# Altium project STM32_PLC.PrjPcb (part 1 of 2)
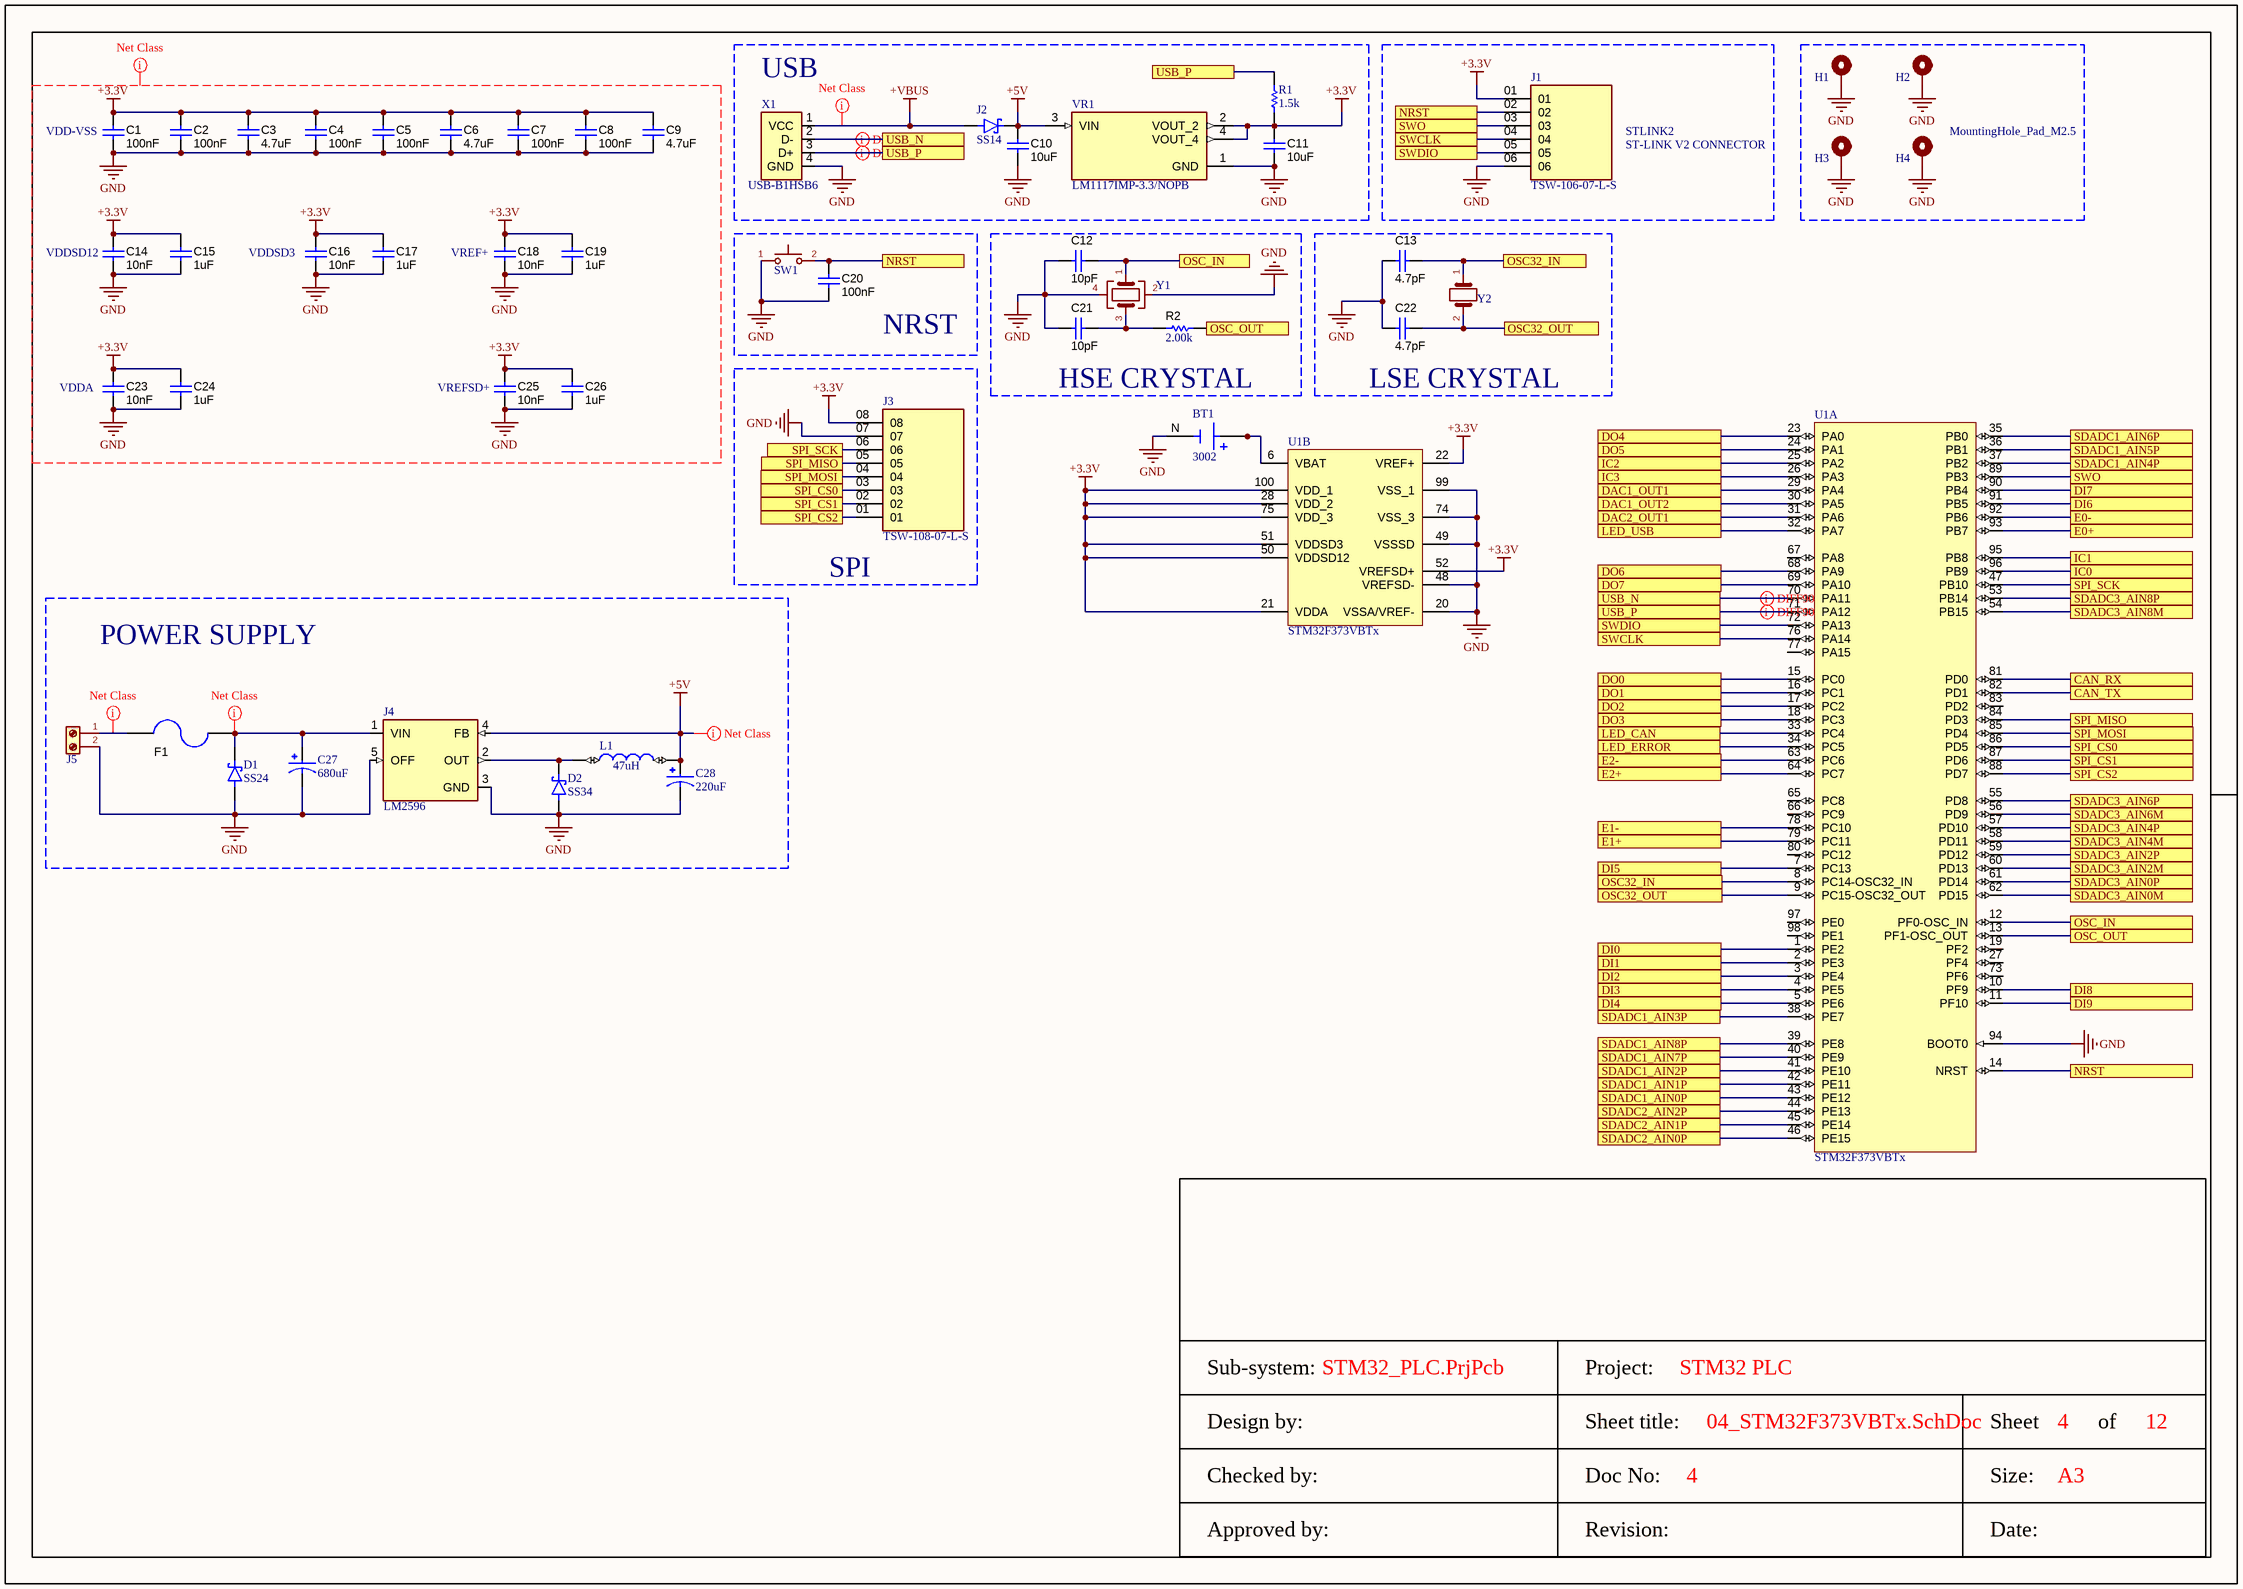
[diagram p0: 04_STM32F373VBTx.SchDoc]
MasterProject: STM32 PLC
9 sheets, 276 parts. Net scope: flat (ports and power ports of the same name join across sheets).
Board file: STM32_PLC.PcbDoc
Sheets:
  02_BLOCK DIAGRAM.SchDoc
  04_STM32F373VBTx.SchDoc
  06_DIGITAL.SchDoc
  07_SDDADC.SchDoc
  08_INPUTCAPTURE_ENCODER.SchDoc
  09_CAN.SchDoc
  10_SDADC.SchDoc
  11_DAC.SchDoc
  12_LED.SchDoc

## Sheet 02_BLOCK DIAGRAM.SchDoc
size 420 x 297 mm; SheetNumber: 2; SheetTotal: 12

### Notes on the sheet
- Sub-system:
- Project:
- Design by:
- Sheet title:
- Sheet
- of
- Checked by:
- Approved by:
- Doc No:
- Revision:
- Size:
- Date:
- A3

## Sheet 04_STM32F373VBTx.SchDoc
size 420 x 297 mm; SheetNumber: 4; SheetTotal: 12

### Parts
BT1  3002  [BAT_3002]
C1  ValueDisplayed: 100nF  [0603]  (hidden comment: CAP 100nF 0603)
C2  ValueDisplayed: 100nF  [0603]  (hidden comment: CAP 100nF 0603)
C3  ValueDisplayed: 4.7uF  [0603]  (hidden comment: CAP 4.7uF 0603)
C4  ValueDisplayed: 100nF  [0603]  (hidden comment: CAP 100nF 0603)
C5  ValueDisplayed: 100nF  [0603]  (hidden comment: CAP 100nF 0603)
C6  ValueDisplayed: 4.7uF  [0603]  (hidden comment: CAP 4.7uF 0603)
C7  ValueDisplayed: 100nF  [0603]  (hidden comment: CAP 100nF 0603)
C8  ValueDisplayed: 100nF  [0603]  (hidden comment: CAP 100nF 0603)
C9  ValueDisplayed: 4.7uF  [0603]  (hidden comment: CAP 4.7uF 0603)
C10  ValueDisplayed: 10uF  [0603]  (hidden comment: GCM188R71C105KA64D)
C11  ValueDisplayed: 10uF  [0603]  (hidden comment: GCM188R71C105KA64D)
C12  ValueDisplayed: 10pF  [0402L]  (hidden comment: CGA2B3X7R1H104K050BB)
C13  ValueDisplayed: 4.7pF  [0402L]  (hidden comment: GJM1555C1H4R7BB01D)
C14  ValueDisplayed: 10nF  [0603]  (hidden comment: CAP 10nF 0603)
C15  ValueDisplayed: 1uF  [0603]  (hidden comment: GCM188R71C105KA64D)
C16  ValueDisplayed: 10nF  [0603]  (hidden comment: CAP 10nF 0603)
C17  ValueDisplayed: 1uF  [0603]  (hidden comment: GCM188R71C105KA64D)
C18  ValueDisplayed: 10nF  [0603]  (hidden comment: CAP 10nF 0603)
C19  ValueDisplayed: 1uF  [0603]  (hidden comment: GCM188R71C105KA64D)
C20  ValueDisplayed: 100nF  [0603]  (hidden comment: CAP 100nF 0603)
C21  ValueDisplayed: 10pF  [0402L]  (hidden comment: CGA2B3X7R1H104K050BB)
C22  ValueDisplayed: 4.7pF  [0402L]  (hidden comment: GJM1555C1H4R7BB01D)
C23  ValueDisplayed: 10nF  [0603]  (hidden comment: CAP 10nF 0603)
C24  ValueDisplayed: 1uF  [0603]  (hidden comment: GCM188R71C105KA64D)
C25  ValueDisplayed: 10nF  [0603]  (hidden comment: CAP 10nF 0603)
C26  ValueDisplayed: 1uF  [0603]  (hidden comment: GCM188R71C105KA64D)
C27  680uF  [CAP_EEETK1V331AQ]
C28  220uF  [CAP_EEEFT1E471AV]
D1  SS24  [DIOM5336X265N]
D2  SS34  [DIOM5336X265N]
F1  0440005.WR  [CAPC4520X203N]  (value not drawn)
H1  MountingHole_Pad M2.5  [MountingHole_2.7mm_M2.5_DIN965_Pad]  (value not drawn)
H2  MountingHole_Pad M2.5  [MountingHole_2.7mm_M2.5_DIN965_Pad]  (value not drawn)
H3  MountingHole_Pad M2.5  [MountingHole_2.7mm_M2.5_DIN965_Pad]  (value not drawn)
H4  MountingHole_Pad M2.5  [MountingHole_2.7mm_M2.5_DIN965_Pad]  (value not drawn)
J1  TSW-106-07-L-S  [SAMTEC_TSW-106-07-L-S]
J2  SS14  [SMA]
J3  TSW-108-07-L-S  [SAMTEC_TSW-108-07-L-S]
J4  LM2596  [TO263-5]
J5  Terminal_01x02_P5.00  [TerminalBlock_Phoenix_PT-1,5-2-5.0-H_1x02_P5.00mm_Horizontal]  (value not drawn)
L1  47uH  [INDPM120120X800N]
R1  ValueDisplayed: 1.5k  [0603]  (hidden comment: RES 1.5K 0603)
R2  ValueDisplayed: 2.00k  [0402L]  (hidden comment: CRCW04021K00FKED)
SW1  SW_Push 3X6x2.5MM  [SW_SPST_FSMSM]  (value not drawn)
U1  STM32F373VBTx  [STM-LQFP100_N]  (parts A,B of 2)
VR1  LM1117IMP-3.3/NOPB  [VREG_LM1117IMP-3.3/NOPB]
X1  USB-B1HSB6  [OST_USB-B1HSB6]
Y1  Crystal 8MHz 3225  [Crystal_SMD_3225-4Pin_3.2x2.5mm_HandSoldering]  (value not drawn)
Y2  Crystal 32.768KHz 3215  [Crystal_SMD_EuroQuartz_EQ161-2Pin_3.2x1.5mm_HandSoldering]  (value not drawn)

### Blocks framed on the sheet
USB: C10 C11 J2 R1 VR1 X1
MountingHole_Pad_M2.5: H1-H4
NRST: C20 SW1
HSE CRYSTAL: C12 C21 R2 Y1
LSE CRYSTAL: C13 C22 Y2
SPI: J3
POWER SUPPLY: C27 C28 D1 D2 F1 J4 J5 L1

### Ports
CAN_RX (see 09_CAN[1A]), CAN_TX (see 09_CAN[1A]), DAC1_OUT1 (see 11_DAC[1A]), DAC1_OUT2 (see 11_DAC[1B]), DAC2_OUT1 (see 11_DAC[2A]), DI0 (see 05_INPUT[2A]), DI1 (see 05_INPUT[2B]), DI2 (see 05_INPUT[2B]), DI3 (see 05_INPUT[2C]), DI4 (see 05_INPUT[2C]), DI5 (see 05_INPUT[3A]), DI6 (see 05_INPUT[3B]), DI7 (see 05_INPUT[3B]), DI8 (see 05_INPUT[3C]), DI9 (see 05_INPUT[3C]), DO0 (see 06_DIGITAL[1A]), DO1 (see 06_DIGITAL[1B]), DO2 (see 06_DIGITAL[1B]), DO3 (see 06_DIGITAL[1C]), DO4 (see 06_DIGITAL[2A]), DO5 (see 06_DIGITAL[2B]), DO6 (see 06_DIGITAL[2B]), DO7 (see 06_DIGITAL[2C]), E0+ (see 08_INPUTCAPTURE_ENCODER[5B]), E0- (see 08_INPUTCAPTURE_ENCODER[5B]), E1+ (see 08_INPUTCAPTURE_ENCODER[5B]), E1- (see 08_INPUTCAPTURE_ENCODER[5B]), E2+ (see 08_INPUTCAPTURE_ENCODER[5B]), E2- (see 08_INPUTCAPTURE_ENCODER[5B]), IC0 (see 08_INPUTCAPTURE_ENCODER[3B]), IC1 (see 08_INPUTCAPTURE_ENCODER[3B]), IC2 (see 08_INPUTCAPTURE_ENCODER[3B]), IC3 (see 08_INPUTCAPTURE_ENCODER[3B]), LED_CAN (see 12_LED[2B]), LED_ERROR (see 12_LED[2B]), LED_USB (see 12_LED[2A]), NRST (see 04_STM32F373VBTx[3A], 04_STM32F373VBTx[4A]), NRST (see 04_STM32F373VBTx[3A], 04_STM32F373VBTx[6C]), NRST (see 04_STM32F373VBTx[4A], 04_STM32F373VBTx[6C]), OSC32_IN (see 04_STM32F373VBTx[5A]), OSC32_IN (see 04_STM32F373VBTx[5C]), OSC32_OUT (see 04_STM32F373VBTx[5A]), OSC32_OUT (see 04_STM32F373VBTx[5C]), OSC_IN (see 04_STM32F373VBTx[4A]), OSC_IN (see 04_STM32F373VBTx[6C]), OSC_OUT (see 04_STM32F373VBTx[4A]), OSC_OUT (see 04_STM32F373VBTx[6C]), SDADC1_AIN0P (see 10_SDADC[3B]), SDADC1_AIN1P (see 10_SDADC[3A]), SDADC1_AIN2P (see 10_SDADC[3A]), SDADC1_AIN3P (see 10_SDADC[2B]), SDADC1_AIN4P (see 10_SDADC[2B]), SDADC1_AIN5P (see 10_SDADC[2A]), SDADC1_AIN6P (see 10_SDADC[2A]), SDADC1_AIN7P (see 10_SDADC[2C]), SDADC1_AIN8P (see 10_SDADC[2B]), SDADC2_AIN0P (see 10_SDADC[3C]), SDADC2_AIN1P (see 10_SDADC[3B]), SDADC2_AIN2P (see 10_SDADC[3B]), SDADC3_AIN0M (see 07_SDDADC[3B]), SDADC3_AIN0P (see 07_SDDADC[3B]), SDADC3_AIN2M (see 07_SDDADC[3A]), SDADC3_AIN2P (see 07_SDDADC[3A]), SDADC3_AIN4M (see 07_SDDADC[2C]), SDADC3_AIN4P (see 07_SDDADC[2B]), SDADC3_AIN6M (see 07_SDDADC[2B]), SDADC3_AIN6P (see 07_SDDADC[2B]), SDADC3_AIN8M (see 07_SDDADC[2A]), SDADC3_AIN8P (see 07_SDDADC[2A]), SPI_CS0 (see 04_STM32F373VBTx[3B]), SPI_CS0 (see 04_STM32F373VBTx[6B]), SPI_CS1 (see 04_STM32F373VBTx[3B]), SPI_CS1 (see 04_STM32F373VBTx[6B]), SPI_CS2 (see 04_STM32F373VBTx[3B]), SPI_CS2 (see 04_STM32F373VBTx[6B]), SPI_MISO (see 04_STM32F373VBTx[3B]), SPI_MISO (see 04_STM32F373VBTx[6B]), SPI_MOSI (see 04_STM32F373VBTx[3B]), SPI_MOSI (see 04_STM32F373VBTx[6B]), SPI_SCK (see 04_STM32F373VBTx[3B]), SPI_SCK (see 04_STM32F373VBTx[6B]), SWCLK (see 04_STM32F373VBTx[4A]), SWCLK (see 04_STM32F373VBTx[5B]), SWDIO (see 04_STM32F373VBTx[4A]), SWDIO (see 04_STM32F373VBTx[5B]), SWO (see 04_STM32F373VBTx[4A]), SWO (see 04_STM32F373VBTx[6B]), USB_N (see 04_STM32F373VBTx[3A]), USB_N (see 04_STM32F373VBTx[5B]), USB_P (see 04_STM32F373VBTx[3A], 04_STM32F373VBTx[4A]), USB_P (see 04_STM32F373VBTx[3A], 04_STM32F373VBTx[5B]), USB_P (see 04_STM32F373VBTx[4A], 04_STM32F373VBTx[5B])

### Nets
+3.3V: C1.1 C2.1 C3.1 C4.1 C5.1 C6.1 C7.1 C8.1 C9.1 C11.1 C14.1 C15.1 C16.1 C17.1 C18.1 C19.1 C23.1 C24.1 C25.1 C26.1 J1.01 J3.08 R1.1 U1.21(VDDA) U1.22(VREF+) U1.28(VDD_2) U1.50(VDDSD12) U1.51(VDDSD3) U1.52(VREFSD+) U1.75(VDD_3) U1.100(VDD_1) VR1.2(VOUT_2) VR1.4(VOUT_4)
+5V: C10.1 C28.1 J2.P2(C) J4.4(FB) L1.2 VR1.3(VIN)
+VBUS: J2.P1(A) X1.1(VCC)
GND: BT1.N(NEG) C1.2 C2.2 C3.2 C4.2 C5.2 C6.2 C7.2 C8.2 C9.2 C10.2 C11.2 C12.2 C13.2 C14.2 C15.2 C16.2 C17.2 C18.2 C19.2 C20.2 C21.2 C22.2 C23.2 C24.2 C25.2 C26.2 C27.2 C28.2 D1.A D2.A H1.1 H2.1 H3.1 H4.1 J1.06 J3.07 J4.3(GND) J4.5(OFF) J5.2(Pin_2) SW1.1 U1.20(VSSA/VREF-) U1.48(VREFSD-) U1.49(VSSSD) U1.74(VSS_3) U1.94(BOOT0) U1.99(VSS_1) VR1.1(GND) X1.4(GND) Y1.2 Y1.4
CAN_RX: U1.81(PD0) ; port CAN_RX
CAN_TX: U1.82(PD1) ; port CAN_TX
DAC1_OUT1: U1.29(PA4) ; port DAC1_OUT1
DAC1_OUT2: U1.30(PA5) ; port DAC1_OUT2
DAC2_OUT1: U1.31(PA6) ; port DAC2_OUT1
DI0: U1.1(PE2) ; port DI0
DI1: U1.2(PE3) ; port DI1
DI2: U1.3(PE4) ; port DI2
DI3: U1.4(PE5) ; port DI3
DI4: U1.5(PE6) ; port DI4
DI5: U1.7(PC13) ; port DI5
DI6: U1.91(PB5) ; port DI6
DI7: U1.90(PB4) ; port DI7
DI8: U1.10(PF9) ; port DI8
DI9: U1.11(PF10) ; port DI9
DO0: U1.15(PC0) ; port DO0
DO1: U1.16(PC1) ; port DO1
DO2: U1.17(PC2) ; port DO2
DO3: U1.18(PC3) ; port DO3
DO4: U1.23(PA0) ; port DO4
DO5: U1.24(PA1) ; port DO5
DO6: U1.68(PA9) ; port DO6
DO7: U1.69(PA10) ; port DO7
E0+: U1.93(PB7) ; port E0+
E0-: U1.92(PB6) ; port E0-
E1+: U1.79(PC11) ; port E1+
E1-: U1.78(PC10) ; port E1-
E2+: U1.64(PC7) ; port E2+
E2-: U1.63(PC6) ; port E2-
IC0: U1.96(PB9) ; port IC0
IC1: U1.95(PB8) ; port IC1
IC2: U1.25(PA2) ; port IC2
IC3: U1.26(PA3) ; port IC3
LED_CAN: U1.33(PC4) ; port LED_CAN
LED_ERROR: U1.34(PC5) ; port LED_ERROR
LED_USB: U1.32(PA7) ; port LED_USB
NRST: C20.1 J1.02 SW1.2 U1.14(NRST) ; port NRST
OSC32_IN: C13.1 U1.8(PC14-OSC32_IN) Y2.1 ; port OSC32_IN
OSC32_OUT: C22.1 U1.9(PC15-OSC32_OUT) Y2.2 ; port OSC32_OUT
OSC_IN: C12.1 U1.12(PF0-OSC_IN) Y1.1 ; port OSC_IN
OSC_OUT: R2.2 U1.13(PF1-OSC_OUT) ; port OSC_OUT
SDADC1_AIN0P: U1.43(PE12) ; port SDADC1_AIN0P
SDADC1_AIN1P: U1.42(PE11) ; port SDADC1_AIN1P
SDADC1_AIN2P: U1.41(PE10) ; port SDADC1_AIN2P
SDADC1_AIN3P: U1.38(PE7) ; port SDADC1_AIN3P
SDADC1_AIN4P: U1.37(PB2) ; port SDADC1_AIN4P
SDADC1_AIN5P: U1.36(PB1) ; port SDADC1_AIN5P
SDADC1_AIN6P: U1.35(PB0) ; port SDADC1_AIN6P
SDADC1_AIN7P: U1.40(PE9) ; port SDADC1_AIN7P
SDADC1_AIN8P: U1.39(PE8) ; port SDADC1_AIN8P
SDADC2_AIN0P: U1.46(PE15) ; port SDADC2_AIN0P
SDADC2_AIN1P: U1.45(PE14) ; port SDADC2_AIN1P
SDADC2_AIN2P: U1.44(PE13) ; port SDADC2_AIN2P
SDADC3_AIN0M: U1.62(PD15) ; port SDADC3_AIN0M
SDADC3_AIN0P: U1.61(PD14) ; port SDADC3_AIN0P
SDADC3_AIN2M: U1.60(PD13) ; port SDADC3_AIN2M
SDADC3_AIN2P: U1.59(PD12) ; port SDADC3_AIN2P
SDADC3_AIN4M: U1.58(PD11) ; port SDADC3_AIN4M
SDADC3_AIN4P: U1.57(PD10) ; port SDADC3_AIN4P
SDADC3_AIN6M: U1.56(PD9) ; port SDADC3_AIN6M
SDADC3_AIN6P: U1.55(PD8) ; port SDADC3_AIN6P
SDADC3_AIN8M: U1.54(PB15) ; port SDADC3_AIN8M
SDADC3_AIN8P: U1.53(PB14) ; port SDADC3_AIN8P
SPI_CS0: J3.03 U1.86(PD5) ; port SPI_CS0
SPI_CS1: J3.02 U1.87(PD6) ; port SPI_CS1
SPI_CS2: J3.01 U1.88(PD7) ; port SPI_CS2
SPI_MISO: J3.05 U1.84(PD3) ; port SPI_MISO
SPI_MOSI: J3.04 U1.85(PD4) ; port SPI_MOSI
SPI_SCK: J3.06 U1.47(PB10) ; port SPI_SCK
SWCLK: J1.04 U1.76(PA14) ; port SWCLK
SWDIO: J1.05 U1.72(PA13) ; port SWDIO
SWO: J1.03 U1.89(PB3) ; port SWO
USB_N: U1.70(PA11) X1.2(D-) ; port USB_N
USB_P: R1.2 U1.71(PA12) X1.3(D+) ; port USB_P
NetBT1_P1: BT1.P1(POS) BT1.P2(POS) U1.6(VBAT)
NetC21_1: C21.1 R2.1 Y1.3
NetC27_1: C27.1 D1.C(K) F1.1 J4.1(VIN)
NetD2_C: D2.C(K) J4.2(OUT) L1.1
NetF1_2: F1.2 J5.1(Pin_1)

Not connected (* = marked no-connect by the designer): U1 19(PF2) 27(PF4) 65(PC8) 66(PC9) 67(PA8) 73(PF6) 77(PA15) 80(PC12) 83(PD2) 97(PE0) 98(PE1)

### Layout directives
net class PWR: +3.3V, +5V, +VBUS, GND, NetC27_1, NetF1_2
differential pair; differential pair class DIFF90: USB_N, USB_P

### Notes on the sheet
- (near C1) VDD-VSS
- STLINK2
- ST-LINK V2 CONNECTOR
- (near C14) VDDSD12
- (near C16) VDDSD3
- (near C18) VREF+
- (near C23) VDDA
- (near C25) VREFSD+
- Sub-system:
- Project:
- Design by:
- Sheet title:
- Sheet
- of
- Checked by:
- Approved by:
- Doc No:
- Revision:
- Size:
- Date:
- A3

### Library data of the parts
BT1 = 3002: Battery Holder: SMT, 1 Coin Cell, 20mm, PhosBronze/Tin-Nickel | Keystone Electronics 3002; MF: Keystone Electronics Corp.; SnapEDA_Link: https://www.snapeda.com/parts/3002/Keystone/view-part/?ref=snap; Package: NON STANDARD-2 Keystone; Value: *; MP: 3002; Check_prices: https://www.snapeda.com/parts/3002/Keystone/view-part/?ref=eda
C1 C2 C4 C5 C7 C8 C20 = CAP 100nF 0603: CAP, CERM, 100 nF, 25 V, +/- 10%, X7R, AEC-Q200 Grade 1, 0603; Manufacturer: MuRata; PartNumber: GCM188R70J225KE22D; TaMin_C: -55°C; Polarized: N; SizeAreaWB_mm2: 4.68; Value1: Unknown; U/M: EA; Value: 2.2uF; TaMax_C: 125°C; SizeZ_mm: 1; SizeX_mm: 1.6; SizeY_mm: 0.8; Value2: 6.3V; SizeArea_mm2: 1.28; CompType: Capacitor; AEC Qualified: Y; Cap_F: 2.2µF; AEC Category: Q200; Supplier Part Number 2: 81-GCM188R70J225KE2D; Publisher: Texas Instruments; Supplier 2: Mouser; TempCo: X7R; Published: 2008-06-19; RoHS: Y; MountType: SMT; Supplier 1: Digi-Key; PackageReference: 0603; Tolerance_%: 10%; Cap_Case: 0603; LatestRevisionDate: 2017-03-09; VDC_V: 6.3V; ComponentLink1Description: Datasheet link; AEC Grade: 1; Supplier Part Number 1: 490-5316-1-ND; Technology: Ceramic; ComponentLink1URL: http://psearch.en.murata.com/capacitor/product/GCM188R70J225KE22%23.pdf
C3 C6 C9 = CAP 4.7uF 0603: CAP, CERM, 4.7 uF, 10 V, +/- 10%, X7R, AEC-Q200 Grade 1, 0603; Manufacturer: MuRata; PartNumber: GCM188R70J225KE22D; TaMin_C: -55°C; Polarized: N; SizeAreaWB_mm2: 4.68; Value1: Unknown; U/M: EA; Value: 2.2uF; TaMax_C: 125°C; SizeZ_mm: 1; SizeX_mm: 1.6; SizeY_mm: 0.8; Value2: 6.3V; SizeArea_mm2: 1.28; CompType: Capacitor; AEC Qualified: Y; Cap_F: 2.2µF; AEC Category: Q200; Supplier Part Number 2: 81-GCM188R70J225KE2D; Publisher: Texas Instruments; Supplier 2: Mouser; TempCo: X7R; Published: 2008-06-19; RoHS: Y; MountType: SMT; Supplier 1: Digi-Key; PackageReference: 0603; Tolerance_%: 10%; Cap_Case: 0603; LatestRevisionDate: 2017-03-09; VDC_V: 6.3V; ComponentLink1Description: Datasheet link; AEC Grade: 1; Supplier Part Number 1: 490-5316-1-ND; Technology: Ceramic; ComponentLink1URL: http://psearch.en.murata.com/capacitor/product/GCM188R70J225KE22%23.pdf
C10 C11 C15 C17 C19 C24 C26 = CAP 1uF 0603: CAP, CERM, 1 uF, 16 V, +/- 10%, X7R, AEC-Q200 Grade 1, 0603; Manufacturer: MuRata; TaMin_C: -55°C; Polarized: N; SizeAreaWB_mm2: 4.68; Value1: Unknown; U/M: EA; Value: 1uF; TaMax_C: 125°C; SizeZ_mm: 1; SizeX_mm: 1.6; SizeY_mm: 0.8; Value2: 16V; SizeArea_mm2: 1.28; CompType: Capacitor; AEC Qualified: Y; Cap_F: 1µF; AEC Category: Q200; Supplier Part Number 2: 81-GCM188R71C105K64D; Publisher: Texas Instruments; Supplier 2: Mouser; TempCo: X7R; Published: 2008-06-19; RoHS: Y; MountType: SMT; Supplier 1: Digi-Key; PackageReference: 0603; Tolerance_%: 10%; Cap_Case: 0603; LatestRevisionDate: 2017-03-09; PartNumber: GCM188R71C105KA64D; VDC_V: 16V; ComponentLink1Description: Datasheet link; AEC Grade: 1; Supplier Part Number 1: 490-5241-6-ND; Technology: Ceramic; ComponentLink1URL: http://psearch.en.murata.com/capacitor/product/GCM188R71C105KA64%23.pdf
C12 C21 = CAP 10pF 0402 50V: CAP, CERM, 10 pF, 50 V, +/- 5%, X7R, AEC-Q200 Grade 1, 0402; Manufacturer: TDK; TaMin_C: -55°C; ESR_ohm: 0.039064; Polarized: N; SizeAreaWB_mm2: 3; Value1: 0.039064 ohm; U/M: EA; Value: 0.1uF; TaMax_C: 125°C; Tolerance_%: 10%; SizeZ_mm: 0.6; SizeX_mm: 1; SizeY_mm: 0.5; Cap_Case: 0402; Value2: 50V; CompType: Capacitor; AEC Qualified: Y; Cap_F: 100nF; IRMS_A: 8.14669dA; AEC Category: Q200; Supplier Part Number 2: 04X3148; Publisher: Texas Instruments; Supplier 2: Newark; Supplier Part Number 3: 810-CGA2B3X7R1H104K; TempCo: X7R; Supplier 3: Mouser; Published: 2008-06-19; RoHS: Y; MountType: SMT; Supplier 1: Digi-Key; PackageReference: 0402; SizeArea_mm2: 0.5; LatestRevisionDate: 2017-03-09; PartNumber: CGA2B3X7R1H104K050BB; VDC_V: 50V; ComponentLink1Description: Datasheet link; AEC Grade: 1; Supplier Part Number 1: 445-6899-1-ND; Technology: Ceramic; ComponentLink1URL: https://product.tdk.com/en/search/capacitor/ceramic/mlcc/info?part_no=CGA2B3X7R1H104K050BB
C13 C22 = CAP 4.7pF 0402: CAP, CERM, 4.7 pF, 50 V, +/- 2%, C0G/NP0, 0402; Manufacturer: MuRata; TaMin_C: -55°C; Polarized: N; SizeAreaWB_mm2: 3; Value1: Unknown; U/M: EA; Value: 4.7pF; TaMax_C: 125°C; SizeZ_mm: 0.6; SizeX_mm: 1; SizeY_mm: 0.5; Cap_Case: 0402; Value2: 50V; CompType: Capacitor; AEC Category: Q200; Supplier Part Number 2: 81-GJM1555C1H4R7BB01; Publisher: Texas Instruments; Supplier 2: Mouser; TempCo: C0G/NP0; Published: 2008-06-19; RoHS: Y; MountType: SMT; Supplier 1: Digi-Key; PackageReference: 0402; Tolerance_%: 2%; SizeArea_mm2: 0.5; LatestRevisionDate: 2017-03-09; PartNumber: GJM1555C1H4R7BB01D; AEC Qualified: N; Cap_F: 4.7pF; VDC_V: 50V; ComponentLink1Description: Datasheet link; AEC Grade: N/A; Supplier Part Number 1: 490-8102-1-ND; Technology: Ceramic; ComponentLink1URL: http://psearch.murata.com/capacitor/product/GJM1555C1H4R7BB01%23.pdf
C14 C16 C18 C23 C25 = CAP 10nF 0603: CAP, CERM, 10 nF, 50 V, +/- 10%, X7R, AEC-Q200 Grade 1, 0603; Manufacturer: MuRata; PartNumber: GCM188R70J225KE22D; TaMin_C: -55°C; Polarized: N; SizeAreaWB_mm2: 4.68; Value1: Unknown; U/M: EA; Value: 2.2uF; TaMax_C: 125°C; SizeZ_mm: 1; SizeX_mm: 1.6; SizeY_mm: 0.8; Value2: 6.3V; SizeArea_mm2: 1.28; CompType: Capacitor; AEC Qualified: Y; Cap_F: 2.2µF; AEC Category: Q200; Supplier Part Number 2: 81-GCM188R70J225KE2D; Publisher: Texas Instruments; Supplier 2: Mouser; TempCo: X7R; Published: 2008-06-19; RoHS: Y; MountType: SMT; Supplier 1: Digi-Key; PackageReference: 0603; Tolerance_%: 10%; Cap_Case: 0603; LatestRevisionDate: 2017-03-09; VDC_V: 6.3V; ComponentLink1Description: Datasheet link; AEC Grade: 1; Supplier Part Number 1: 490-5316-1-ND; Technology: Ceramic; ComponentLink1URL: http://psearch.en.murata.com/capacitor/product/GCM188R70J225KE22%23.pdf
C27 = CAP ALUMINUM: CAPACITOR ALUM ELEC, 330UF, 20%, 35V, SMD; Product Range:PANASONIC - TK Series; Capacitance:330ÂµF; Capacitance Tolerance:Â± 20%; Capacitor Case Style:SMD; Diameter:12.5mm; ESR:0.12ohm; Height:13.5mm; Operating Temperature Max:125Â°C ;RoHS Compliant: Yes; MP: EEETK1V331AQ; Value: *; Price: None; Package: RADIAL-2 Panasonic; MF: Panasonic; Availability: No availability data; Check_prices: https://www.snapeda.com/parts/EEETK1V331AQ/Panasonic/view-part/5787067/?ref=eda; SnapEDA_Link: https://www.snapeda.com/parts/EEETK1V331AQ/Panasonic/view-part/5787067/?ref=snap
C28 = CAP ALUMINUM 8X10.5MM: Aluminum Electrolytic Capacitors, FT-V (????????) Series, 470uF +/- 20%, 25V, Surface mount type(8x10.5mm) Vibration-proof product; MF: Panasonic; MP: EEE-FT1E471AV; SnapEDA_Link: https://www.snapeda.com/parts/EEE-FT1E471AV/Panasonic/view-part/?ref=snap; Package: RADIAL-2 Panasonic; Value: *; Check_prices: https://www.snapeda.com/parts/EEE-FT1E471AV/Panasonic/view-part/?ref=eda
D1 D2 = SS24: Diode Schottky 40V 2A Surface Mount DO-214AA (SMB); MF: ON Semiconductor; Package: DO-214AA ON Semiconductor; Price: None; Value: *; SnapEDA_Link: https://www.snapeda.com/parts/SS24/Onsemi/view-part/?ref=snap; MP: SS24; Availability: In Stock; Check_prices: https://www.snapeda.com/parts/SS24/Onsemi/view-part/?ref=eda
F1 = FUSE 1808: Fuse, 5 A, 32VAC/VDC, SMD; Manufacturer: Littelfuse; Irating_A: 5A; SizeAreaWB_mm2: 10.92; Interrupt_AC: 50A; VAC_V: 32V; SizeZ_mm: 1.35; SizeX_mm: 3.2; SizeY_mm: 1.6; SizeArea_mm2: 5.12; Rtyp_Ohm: 0.012; MeltingTyp: 4.761; ComponentLink1URL: http://www.littelfuse.com/~/media/electronics/datasheets/fuses/littelfuse_fuse_440_datasheet.pdf.pdf; Supplier Part Number 2: 64R8013; Supplier 2: Newark; Supplier Part Number 3: 576-0440005.WR; Supplier 3: Mouser; RoHS: Y; MountType: SMT; Interrupt_DC: 50A; Supplier 1: Digi-Key; PackageReference: 1206; CompType: Fuse; PartNumber: 0440005.WR; VDC_V: 32V; ComponentLink1Description: Datasheet URL; Supplier Part Number 1: F1608CT-ND
J1 = TSW-106-07-L-S: MF: Samtec Inc.; Package: None; MP: TSW-106-07-L-S; Price: None; Value: *; Availability: Unavailable
J2 = SS14: Diode Schottky 40 V 1A Surface Mount DO-214AC (SMA); MF: ON; SnapEDA_Link: https://www.snapeda.com/parts/SS14/Onsemi/view-part/?ref=snap; Package: SMA-2 ON Semiconductor; Value: *; MP: SS14; Check_prices: https://www.snapeda.com/parts/SS14/Onsemi/view-part/?ref=eda
J3 = TSW-108-07-L-S: MF: Samtec Inc.; Availability: Unavailable; Price: None; Package: None; Value: *; MP: TSW-108-07-L-S
J4 = LM2596: MF: Texas Instruments; SnapEDA_Link: https://www.snapeda.com/parts/LM2596/Texas+Instruments/view-part/?ref=snap; Package: Package; Value: *; MP: LM2596; Check_prices: https://www.snapeda.com/parts/LM2596/Texas+Instruments/view-part/?ref=eda
L1 = CDRH127_LDNP-221MC: 220 ÂµH Shielded - Inductor 1.45 A 338mOhm Max Nonstandard; MF: Sumida America; MP: CDRH127/LDNP-221MC; SnapEDA_Link: https://www.snapeda.com/parts/CDRH127/LDNP-221MC/Sumida+America+Components+Inc./view-part/?ref=snap; Package: Nonstandard Sumida; Value: *; Check_prices: https://www.snapeda.com/parts/CDRH127/LDNP-221MC/Sumida+America+Components+Inc./view-part/?ref=eda
R1 = RES 1.5K 0603 1%: RES, 1.5K, 1%, 0.1 W, AEC-Q200 Grade 0, 0603; Manufacturer: Vishay-Dale; PartNumber: CRCW060320R0JNEA; Power_W: 100mW; TempCo: 200 ppm/C; Value_Code: 20R0; Value1: 5%; Value: 20; EIA_Code: E24; SizeX_mm: 1.6; SizeY_mm: 0.8; SizeZ_mm: 1; Value2: 0.1W; SizeArea_mm2: 1.28; CompType: Resistor; AEC Qualified: Y; VDC_V: 75V; AEC Category: Q200; AEC Grade: 0; Supplier Part Number 2: 59M6784; Supplier 2: Newark; Supplier Part Number 3: 71-CRCW0603J-20-E3; Supplier 3: Mouser; RoHS: E; MountType: SMT; Supplier 1: Digi-Key; PackageReference: 0603; Tolerance_%: 5%; Res_ohm: 20; ComponentLink1Description: Datasheet link; Supplier Part Number 1: 541-20GCT-ND; Technology: Thick Film; ComponentLink1URL: http://www.vishay.com/docs/20035/dcrcwe3.pdf
R2 = RES 2K 0402: RES, 2.00 k, 5%, 0.063 W, AEC-Q200 Grade 0, 0402; Manufacturer: Vishay-Dale; Power_W: 63mW; TempCo: 100 ppm/C; Value_Code: 1k00; Value1: 1%; Value: 1.00k; EIA_Code: E96; Res_ohm: 1k; SizeX_mm: 1; SizeY_mm: 0.5; SizeZ_mm: 0.6; Value2: 0.063W; CompType: Resistor; AEC Qualified: Y; VDC_V: 50V; AEC Category: Q200; AEC Grade: 0; Supplier Part Number 2: 52K6545; Supplier 2: Newark; Supplier Part Number 3: 71-CRCW0402-1.0K-E3; Supplier 3: Mouser; RoHS: E; MountType: SMT; Supplier 1: Digi-Key; PackageReference: 0402; Tolerance_%: 1%; SizeArea_mm2: 0.5; PartNumber: CRCW04021K00FKED; ComponentLink1Description: Datasheet link; Supplier Part Number 1: 541-1.00KLCT-ND; Technology: Thick Film; ComponentLink1URL: http://www.vishay.com/docs/20035/dcrcwe3.pdf
U1 = STM32F373VBT7: ARM Cortex-M4 32-bit MCU, 128 KB Flash, 24 KB Internal RAM, 84 I/Os, 100-pin LQFP, -40 to 105 degC, Tray; Supply Voltage(Vcc) min (V): 2; Operating Frequency(F) (Processor speed) (MHz): 72; I/Os (High Current): 84; Internal RAM Size (kB): 24; FLASH Size (Prog) (kB): 128; DatasheetVersion: Rev. 3; Mounting Technology: Surface Mount; ComponentLink1Description: Manufacturer URL; Core: ARM Cortex-M4; ComponentLink2Description: Datasheet; PackageReference: LQFP100; PackageVersion: Rev. 1, 06/2013; ComponentLink3URL: http://www.st.com/st-web-ui/static/active/en/resource/technical/document/data_brief/DM00071938.pdf; PackageDescription: 100-Pin Low Profile Quad Flat Package, 14 x 14 mm Body, 0.5 mm Pitch; ComponentLink1URL: http://www.st.com/web/en/home.html; Packing: Tray; ComponentLink3Description: Package Specification; ComponentLink2URL: http://www.st.com/st-web-ui/static/active/en/resource/technical/document/datasheet/DM00046749.pdf; PartNumber: STM32F373VBT7
VR1 = LM1117IMP-3.3/NOPB: 800-mA 15-V linear voltage regulator; MF: Texas Instruments; SnapEDA_Link: https://www.snapeda.com/parts/LM1117IMP-3.3/NOPB/Texas+Instruments/view-part/?ref=snap; Package: SOT-223-4 Texas Instruments; Value: *; MP: LM1117IMP-3.3/NOPB; Check_prices: https://www.snapeda.com/parts/LM1117IMP-3.3/NOPB/Texas+Instruments/view-part/?ref=eda
X1 = USB-B1HSB6: USB-B (USB TYPE-B) - Receptacle Connector 4 Position Through Hole, Right Angle; MF: On Shore; Check_prices: https://www.snapeda.com/parts/USB-B1HSB6/On+Shore+Technology+Inc./view-part/?ref=eda; Value: *; Purchase-URL: https://pricing.snapeda.com/search/part/USB-B1HSB6/?ref=eda; Price: None; MP: USB-B1HSB6; SnapEDA_Link: https://www.snapeda.com/parts/USB-B1HSB6/On+Shore+Technology+Inc./view-part/?ref=snap; Availability: In Stock; Package: None

## Sheet 06_DIGITAL.SchDoc
size 420 x 297 mm; SheetNumber: 6; SheetTotal: 12
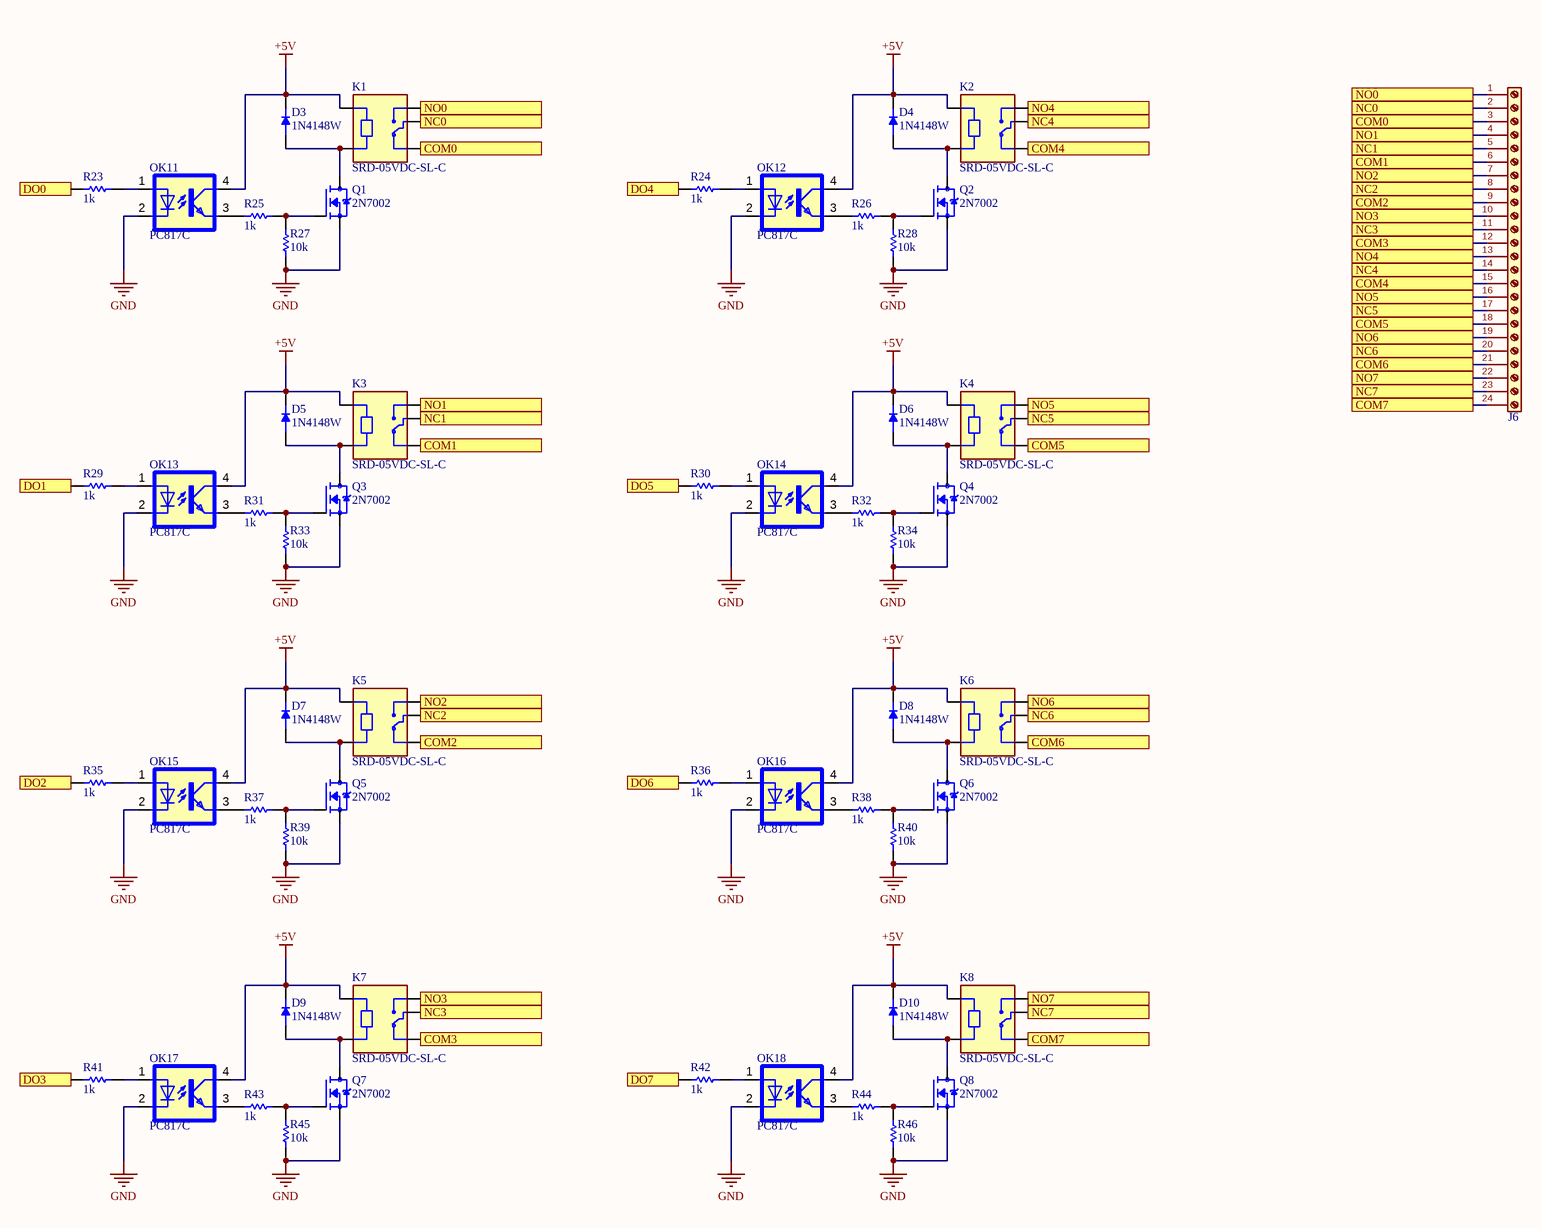
[diagram p1: 06_DIGITAL.SchDoc]

### Parts
D3  1N4148W  [SOD3715X135N]
D4  1N4148W  [SOD3715X135N]
D5  1N4148W  [SOD3715X135N]
D6  1N4148W  [SOD3715X135N]
D7  1N4148W  [SOD3715X135N]
D8  1N4148W  [SOD3715X135N]
D9  1N4148W  [SOD3715X135N]
D10  1N4148W  [SOD3715X135N]
J6  Terminal_01x24_P5.00  [TerminalBlock_Phoenix_PT-1,5-24-5.0-H_1x24_P5.00mm_Horizontal]  (value not drawn)
K1  SRD-05VDC-SL-C  [RELAY_SRD-05VDC-SL-C]
K2  SRD-05VDC-SL-C  [RELAY_SRD-05VDC-SL-C]
K3  SRD-05VDC-SL-C  [RELAY_SRD-05VDC-SL-C]
K4  SRD-05VDC-SL-C  [RELAY_SRD-05VDC-SL-C]
K5  SRD-05VDC-SL-C  [RELAY_SRD-05VDC-SL-C]
K6  SRD-05VDC-SL-C  [RELAY_SRD-05VDC-SL-C]
K7  SRD-05VDC-SL-C  [RELAY_SRD-05VDC-SL-C]
K8  SRD-05VDC-SL-C  [RELAY_SRD-05VDC-SL-C]
OK11  PC817C  [SOP254P975X460-4N]
OK12  PC817C  [SOP254P975X460-4N]
OK13  PC817C  [SOP254P975X460-4N]
OK14  PC817C  [SOP254P975X460-4N]
OK15  PC817C  [SOP254P975X460-4N]
OK16  PC817C  [SOP254P975X460-4N]
OK17  PC817C  [SOP254P975X460-4N]
OK18  PC817C  [SOP254P975X460-4N]
Q1  2N7002  [SOT95P240X111-3N]
Q2  2N7002  [SOT95P240X111-3N]
Q3  2N7002  [SOT95P240X111-3N]
Q4  2N7002  [SOT95P240X111-3N]
Q5  2N7002  [SOT95P240X111-3N]
Q6  2N7002  [SOT95P240X111-3N]
Q7  2N7002  [SOT95P240X111-3N]
Q8  2N7002  [SOT95P240X111-3N]
R23  ValueDisplayed: 1k  [0603]  (hidden comment: RES 10K 0603)
R24  ValueDisplayed: 1k  [0603]  (hidden comment: RES 10K 0603)
R25  ValueDisplayed: 1k  [0603]  (hidden comment: RES 10K 0603)
R26  ValueDisplayed: 1k  [0603]  (hidden comment: RES 10K 0603)
R27  ValueDisplayed: 10k  [0603]  (hidden comment: RES 10K 0603)
R28  ValueDisplayed: 10k  [0603]  (hidden comment: RES 10K 0603)
R29  ValueDisplayed: 1k  [0603]  (hidden comment: RES 10K 0603)
R30  ValueDisplayed: 1k  [0603]  (hidden comment: RES 10K 0603)
R31  ValueDisplayed: 1k  [0603]  (hidden comment: RES 10K 0603)
R32  ValueDisplayed: 1k  [0603]  (hidden comment: RES 10K 0603)
R33  ValueDisplayed: 10k  [0603]  (hidden comment: RES 10K 0603)
R34  ValueDisplayed: 10k  [0603]  (hidden comment: RES 10K 0603)
R35  ValueDisplayed: 1k  [0603]  (hidden comment: RES 10K 0603)
R36  ValueDisplayed: 1k  [0603]  (hidden comment: RES 10K 0603)
R37  ValueDisplayed: 1k  [0603]  (hidden comment: RES 10K 0603)
R38  ValueDisplayed: 1k  [0603]  (hidden comment: RES 10K 0603)
R39  ValueDisplayed: 10k  [0603]  (hidden comment: RES 10K 0603)
R40  ValueDisplayed: 10k  [0603]  (hidden comment: RES 10K 0603)
R41  ValueDisplayed: 1k  [0603]  (hidden comment: RES 10K 0603)
R42  ValueDisplayed: 1k  [0603]  (hidden comment: RES 10K 0603)
R43  ValueDisplayed: 1k  [0603]  (hidden comment: RES 10K 0603)
R44  ValueDisplayed: 1k  [0603]  (hidden comment: RES 10K 0603)
R45  ValueDisplayed: 10k  [0603]  (hidden comment: RES 10K 0603)
R46  ValueDisplayed: 10k  [0603]  (hidden comment: RES 10K 0603)

### Ports
COM0 (see 06_DIGITAL[2A]), COM0 (see 06_DIGITAL[4A]), COM1 (see 06_DIGITAL[2B]), COM1 (see 06_DIGITAL[4A]), COM2 (see 06_DIGITAL[2B]), COM2 (see 06_DIGITAL[4A]), COM3 (see 06_DIGITAL[2C]), COM3 (see 06_DIGITAL[4A]), COM4 (see 06_DIGITAL[3A]), COM4 (see 06_DIGITAL[4A]), COM5 (see 06_DIGITAL[3B]), COM5 (see 06_DIGITAL[4A]), COM6 (see 06_DIGITAL[3B]), COM6 (see 06_DIGITAL[4A]), COM7 (see 06_DIGITAL[3C]), COM7 (see 06_DIGITAL[4B]), DO0 (see 04_STM32F373VBTx[5B]), DO1 (see 04_STM32F373VBTx[5B]), DO2 (see 04_STM32F373VBTx[5B]), DO3 (see 04_STM32F373VBTx[5B]), DO4 (see 04_STM32F373VBTx[5B]), DO5 (see 04_STM32F373VBTx[5B]), DO6 (see 04_STM32F373VBTx[5B]), DO7 (see 04_STM32F373VBTx[5B]), NC0 (see 06_DIGITAL[2A]), NC0 (see 06_DIGITAL[4A]), NC1 (see 06_DIGITAL[2B]), NC1 (see 06_DIGITAL[4A]), NC2 (see 06_DIGITAL[2B]), NC2 (see 06_DIGITAL[4A]), NC3 (see 06_DIGITAL[2C]), NC3 (see 06_DIGITAL[4A]), NC4 (see 06_DIGITAL[3A]), NC4 (see 06_DIGITAL[4A]), NC5 (see 06_DIGITAL[3B]), NC5 (see 06_DIGITAL[4A]), NC6 (see 06_DIGITAL[3B]), NC6 (see 06_DIGITAL[4A]), NC7 (see 06_DIGITAL[3C]), NC7 (see 06_DIGITAL[4A]), NO0 (see 06_DIGITAL[2A]), NO0 (see 06_DIGITAL[4A]), NO1 (see 06_DIGITAL[2B]), NO1 (see 06_DIGITAL[4A]), NO2 (see 06_DIGITAL[2B]), NO2 (see 06_DIGITAL[4A]), NO3 (see 06_DIGITAL[2C]), NO3 (see 06_DIGITAL[4A]), NO4 (see 06_DIGITAL[3A]), NO4 (see 06_DIGITAL[4A]), NO5 (see 06_DIGITAL[3B]), NO5 (see 06_DIGITAL[4A]), NO6 (see 06_DIGITAL[3B]), NO6 (see 06_DIGITAL[4A]), NO7 (see 06_DIGITAL[3C]), NO7 (see 06_DIGITAL[4A])

### Nets
+5V: D3.C(K) D4.C(K) D5.C(K) D6.C(K) D7.C(K) D8.C(K) D9.C(K) D10.C(K) K1.A1 K2.A1 K3.A1 K4.A1 K5.A1 K6.A1 K7.A1 K8.A1 OK11.4(COL) OK12.4(COL) OK13.4(COL) OK14.4(COL) OK15.4(COL) OK16.4(COL) OK17.4(COL) OK18.4(COL)
GND: OK11.2(C) OK12.2(C) OK13.2(C) OK14.2(C) OK15.2(C) OK16.2(C) OK17.2(C) OK18.2(C) Q1.2(S) Q2.2(S) Q3.2(S) Q4.2(S) Q5.2(S) Q6.2(S) Q7.2(S) Q8.2(S) R27.2 R28.2 R33.2 R34.2 R39.2 R40.2 R45.2 R46.2
COM0: J6.3(Pin_3) K1.NC ; port COM0
COM1: J6.6(Pin_6) K3.NC ; port COM1
COM2: J6.9(Pin_9) K5.NC ; port COM2
COM3: J6.12(Pin_12) K7.NC ; port COM3
COM4: J6.15(Pin_15) K2.NC ; port COM4
COM5: J6.18(Pin_18) K4.NC ; port COM5
COM6: J6.21(Pin_21) K6.NC ; port COM6
COM7: J6.24(Pin_24) K8.NC ; port COM7
DO0: R23.2 ; port DO0
DO1: R29.2 ; port DO1
DO2: R35.2 ; port DO2
DO3: R41.2 ; port DO3
DO4: R24.2 ; port DO4
DO5: R30.2 ; port DO5
DO6: R36.2 ; port DO6
DO7: R42.2 ; port DO7
NC0: J6.2(Pin_2) K1.COM ; port NC0
NC1: J6.5(Pin_5) K3.COM ; port NC1
NC2: J6.8(Pin_8) K5.COM ; port NC2
NC3: J6.11(Pin_11) K7.COM ; port NC3
NC4: J6.14(Pin_14) K2.COM ; port NC4
NC5: J6.17(Pin_17) K4.COM ; port NC5
NC6: J6.20(Pin_20) K6.COM ; port NC6
NC7: J6.23(Pin_23) K8.COM ; port NC7
NO0: J6.1(Pin_1) K1.NO ; port NO0
NO1: J6.4(Pin_4) K3.NO ; port NO1
NO2: J6.7(Pin_7) K5.NO ; port NO2
NO3: J6.10(Pin_10) K7.NO ; port NO3
NO4: J6.13(Pin_13) K2.NO ; port NO4
NO5: J6.16(Pin_16) K4.NO ; port NO5
NO6: J6.19(Pin_19) K6.NO ; port NO6
NO7: J6.22(Pin_22) K8.NO ; port NO7
NetD3_A: D3.A K1.A2 Q1.3(D)
NetD4_A: D4.A K2.A2 Q2.3(D)
NetD5_A: D5.A K3.A2 Q3.3(D)
NetD6_A: D6.A K4.A2 Q4.3(D)
NetD7_A: D7.A K5.A2 Q5.3(D)
NetD8_A: D8.A K6.A2 Q6.3(D)
NetD9_A: D9.A K7.A2 Q7.3(D)
NetD10_A: D10.A K8.A2 Q8.3(D)
NetOK11_1: OK11.1(A) R23.1
NetOK11_3: OK11.3(EMIT) R25.2
NetOK12_1: OK12.1(A) R24.1
NetOK12_3: OK12.3(EMIT) R26.2
NetOK13_1: OK13.1(A) R29.1
NetOK13_3: OK13.3(EMIT) R31.2
NetOK14_1: OK14.1(A) R30.1
NetOK14_3: OK14.3(EMIT) R32.2
NetOK15_1: OK15.1(A) R35.1
NetOK15_3: OK15.3(EMIT) R37.2
NetOK16_1: OK16.1(A) R36.1
NetOK16_3: OK16.3(EMIT) R38.2
NetOK17_1: OK17.1(A) R41.1
NetOK17_3: OK17.3(EMIT) R43.2
NetOK18_1: OK18.1(A) R42.1
NetOK18_3: OK18.3(EMIT) R44.2
NetQ1_1: Q1.1(G) R25.1 R27.1
NetQ2_1: Q2.1(G) R26.1 R28.1
NetQ3_1: Q3.1(G) R31.1 R33.1
NetQ4_1: Q4.1(G) R32.1 R34.1
NetQ5_1: Q5.1(G) R37.1 R39.1
NetQ6_1: Q6.1(G) R38.1 R40.1
NetQ7_1: Q7.1(G) R43.1 R45.1
NetQ8_1: Q8.1(G) R44.1 R46.1

### Notes on the sheet
- Sub-system:
- Project:
- Design by:
- Sheet title:
- Sheet
- of
- Checked by:
- Approved by:
- Doc No:
- Revision:
- Size:
- Date:
- A3

### Library data of the parts
D3-D10 = 1N4148W: Diode Standard 100 V 300mA (DC) Surface Mount SOD-123; MF: Diodes Inc.; MP: 1N4148W-7; SnapEDA_Link: https://www.snapeda.com/parts/1N4148W-7/Diodes+Inc./view-part/?ref=snap; Package: SOD-123 Fairchild Semiconductor; Value: *; Check_prices: https://www.snapeda.com/parts/1N4148W-7/Diodes+Inc./view-part/?ref=eda
K1-K8 = SRD-05VDC-SL-C: 5V Trigger Relay Module For Arduino And Raspberry Pi 5V Trigger Relay Module For Arduino And Raspberry Pi; MF: Songle Relay; Check_prices: https://www.snapeda.com/parts/SRD-05VDC-SL-C/Songle+Relay/view-part/?ref=eda; Value: *; Availability: Not in stock; Price: None; Package: NON STANDARD-5 Songle Relay; MP: SRD-05VDC-SL-C; SnapEDA_Link: https://www.snapeda.com/parts/SRD-05VDC-SL-C/Songle+Relay/view-part/?ref=snap
OK11-OK18 = PC817C: RF Mixer IC Cellular, DCS, PCS, W-CDMA, WLAN Up Converter 50MHz ~ 400MHz 6-SuperMiniMold; MF: Renesas Electronics America Inc; MP: PC817; SnapEDA_Link: https://www.snapeda.com/parts/PC817/Renesas/view-part/?ref=snap; Package: None; Value: *; Check_prices: https://www.snapeda.com/parts/PC817/Renesas/view-part/?ref=eda
Q1-Q8 = 2N7002: Mosfet Array 2 N-Channel (Dual) 60V 300mA 500mW Surface Mount PG-SOT363-6; MF: onsemi; SnapEDA_Link: https://www.snapeda.com/parts/2N7002/Onsemi/view-part/?ref=snap; Package: SOT-23-3 ON Semiconductor; Value: *; MP: 2N7002; Check_prices: https://www.snapeda.com/parts/2N7002/Onsemi/view-part/?ref=eda
R23-R46 = RES 10K 0603 1%: RES, 10K, 1%, 0.1 W, AEC-Q200 Grade 0, 0603; Manufacturer: Vishay-Dale; PartNumber: CRCW060320R0JNEA; Power_W: 100mW; TempCo: 200 ppm/C; Value_Code: 20R0; Value1: 5%; Value: 20; EIA_Code: E24; SizeX_mm: 1.6; SizeY_mm: 0.8; SizeZ_mm: 1; Value2: 0.1W; SizeArea_mm2: 1.28; CompType: Resistor; AEC Qualified: Y; VDC_V: 75V; AEC Category: Q200; AEC Grade: 0; Supplier Part Number 2: 59M6784; Supplier 2: Newark; Supplier Part Number 3: 71-CRCW0603J-20-E3; Supplier 3: Mouser; RoHS: E; MountType: SMT; Supplier 1: Digi-Key; PackageReference: 0603; Tolerance_%: 5%; Res_ohm: 20; ComponentLink1Description: Datasheet link; Supplier Part Number 1: 541-20GCT-ND; Technology: Thick Film; ComponentLink1URL: http://www.vishay.com/docs/20035/dcrcwe3.pdf

## Sheet 07_SDDADC.SchDoc
size 420 x 297 mm; SheetNumber: 7; SheetTotal: 12
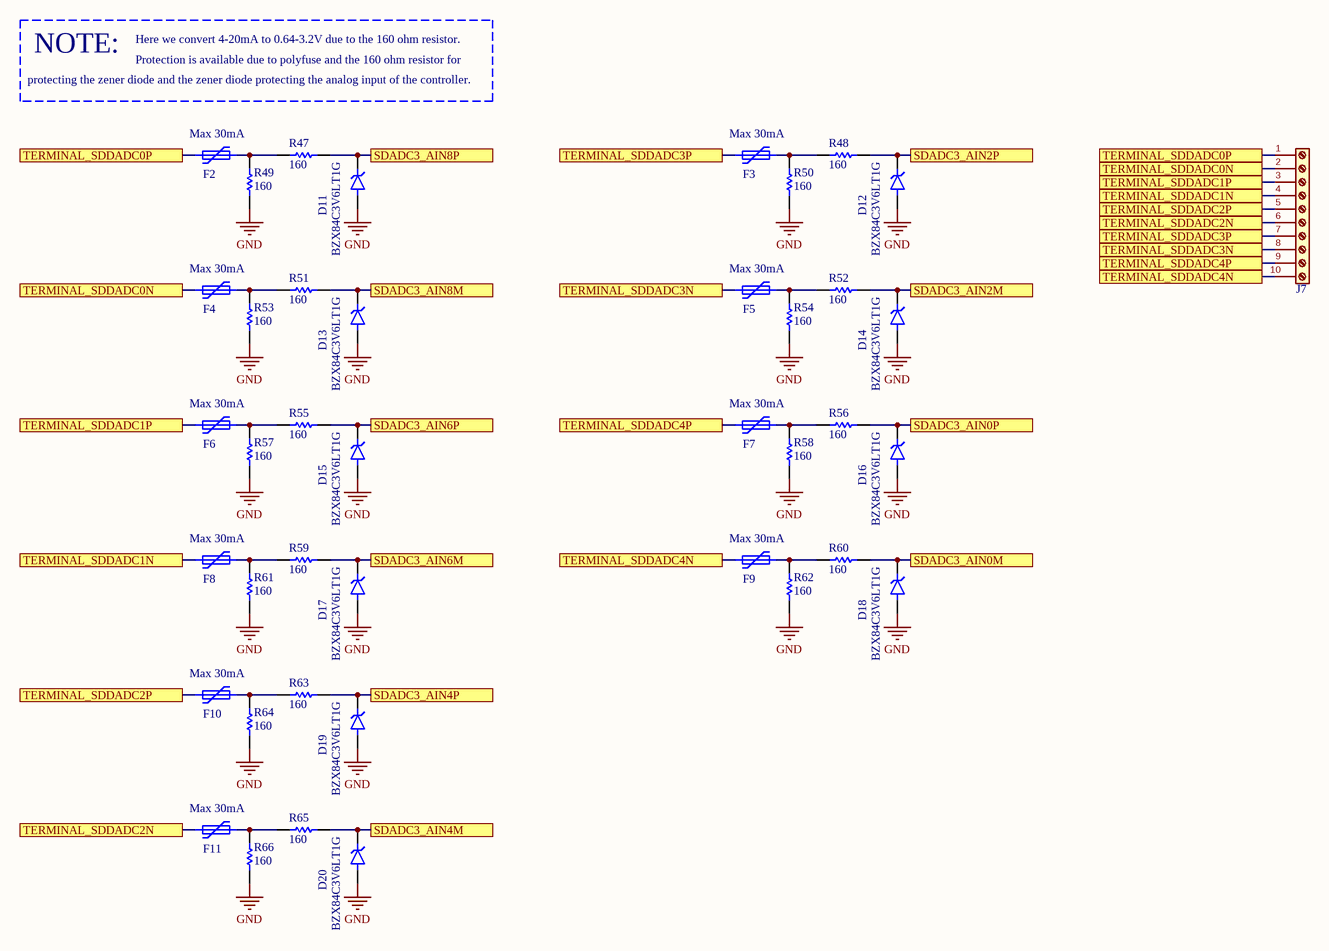
[diagram p2: 07_SDDADC.SchDoc]

### Parts
D11  BZX84C3V6LT1G  [SOT95P240X111-3N]
D12  BZX84C3V6LT1G  [SOT95P240X111-3N]
D13  BZX84C3V6LT1G  [SOT95P240X111-3N]
D14  BZX84C3V6LT1G  [SOT95P240X111-3N]
D15  BZX84C3V6LT1G  [SOT95P240X111-3N]
D16  BZX84C3V6LT1G  [SOT95P240X111-3N]
D17  BZX84C3V6LT1G  [SOT95P240X111-3N]
D18  BZX84C3V6LT1G  [SOT95P240X111-3N]
D19  BZX84C3V6LT1G  [SOT95P240X111-3N]
D20  BZX84C3V6LT1G  [SOT95P240X111-3N]
F2  Max 30mA  [Fuse_0603_1608Metric]
F3  Max 30mA  [Fuse_0603_1608Metric]
F4  Max 30mA  [Fuse_0603_1608Metric]
F5  Max 30mA  [Fuse_0603_1608Metric]
F6  Max 30mA  [Fuse_0603_1608Metric]
F7  Max 30mA  [Fuse_0603_1608Metric]
F8  Max 30mA  [Fuse_0603_1608Metric]
F9  Max 30mA  [Fuse_0603_1608Metric]
F10  Max 30mA  [Fuse_0603_1608Metric]
F11  Max 30mA  [Fuse_0603_1608Metric]
J7  Terminal_01x10_P5.00  [TerminalBlock_Phoenix_PT-1,5-10-5.0-H_1x10_P5.00mm_Horizontal]  (value not drawn)
R47  ValueDisplayed: 160  [0603]  (hidden comment: CRCW060320R0JNEA)
R48  ValueDisplayed: 160  [0603]  (hidden comment: CRCW060320R0JNEA)
R49  ValueDisplayed: 160  [0603]  (hidden comment: CRCW060320R0JNEA)
R50  ValueDisplayed: 160  [0603]  (hidden comment: CRCW060320R0JNEA)
R51  ValueDisplayed: 160  [0603]  (hidden comment: CRCW060320R0JNEA)
R52  ValueDisplayed: 160  [0603]  (hidden comment: CRCW060320R0JNEA)
R53  ValueDisplayed: 160  [0603]  (hidden comment: CRCW060320R0JNEA)
R54  ValueDisplayed: 160  [0603]  (hidden comment: CRCW060320R0JNEA)
R55  ValueDisplayed: 160  [0603]  (hidden comment: CRCW060320R0JNEA)
R56  ValueDisplayed: 160  [0603]  (hidden comment: CRCW060320R0JNEA)
R57  ValueDisplayed: 160  [0603]  (hidden comment: CRCW060320R0JNEA)
R58  ValueDisplayed: 160  [0603]  (hidden comment: CRCW060320R0JNEA)
R59  ValueDisplayed: 160  [0603]  (hidden comment: CRCW060320R0JNEA)
R60  ValueDisplayed: 160  [0603]  (hidden comment: CRCW060320R0JNEA)
R61  ValueDisplayed: 160  [0603]  (hidden comment: CRCW060320R0JNEA)
R62  ValueDisplayed: 160  [0603]  (hidden comment: CRCW060320R0JNEA)
R63  ValueDisplayed: 160  [0603]  (hidden comment: CRCW060320R0JNEA)
R64  ValueDisplayed: 160  [0603]  (hidden comment: CRCW060320R0JNEA)
R65  ValueDisplayed: 160  [0603]  (hidden comment: CRCW060320R0JNEA)
R66  ValueDisplayed: 160  [0603]  (hidden comment: CRCW060320R0JNEA)

### Ports
SDADC3_AIN0M (see 04_STM32F373VBTx[6C]), SDADC3_AIN0P (see 04_STM32F373VBTx[6C]), SDADC3_AIN2M (see 04_STM32F373VBTx[6C]), SDADC3_AIN2P (see 04_STM32F373VBTx[6C]), SDADC3_AIN4M (see 04_STM32F373VBTx[6C]), SDADC3_AIN4P (see 04_STM32F373VBTx[6C]), SDADC3_AIN6M (see 04_STM32F373VBTx[6C]), SDADC3_AIN6P (see 04_STM32F373VBTx[6C]), SDADC3_AIN8M (see 04_STM32F373VBTx[6B]), SDADC3_AIN8P (see 04_STM32F373VBTx[6B]), TERMINAL_SDDADC0N (see 07_SDDADC[1A]), TERMINAL_SDDADC0N (see 07_SDDADC[4A]), TERMINAL_SDDADC0P (see 07_SDDADC[1A]), TERMINAL_SDDADC0P (see 07_SDDADC[4A]), TERMINAL_SDDADC1N (see 07_SDDADC[1B]), TERMINAL_SDDADC1N (see 07_SDDADC[4A]), TERMINAL_SDDADC1P (see 07_SDDADC[1B]), TERMINAL_SDDADC1P (see 07_SDDADC[4A]), TERMINAL_SDDADC2N (see 07_SDDADC[1C]), TERMINAL_SDDADC2N (see 07_SDDADC[4A]), TERMINAL_SDDADC2P (see 07_SDDADC[1B]), TERMINAL_SDDADC2P (see 07_SDDADC[4A]), TERMINAL_SDDADC3N (see 07_SDDADC[2A]), TERMINAL_SDDADC3N (see 07_SDDADC[4A]), TERMINAL_SDDADC3P (see 07_SDDADC[2A]), TERMINAL_SDDADC3P (see 07_SDDADC[4A]), TERMINAL_SDDADC4N (see 07_SDDADC[2B]), TERMINAL_SDDADC4N (see 07_SDDADC[4A]), TERMINAL_SDDADC4P (see 07_SDDADC[2B]), TERMINAL_SDDADC4P (see 07_SDDADC[4A])

### Nets
GND: D11.1(A) D12.1(A) D13.1(A) D14.1(A) D15.1(A) D16.1(A) D17.1(A) D18.1(A) D19.1(A) D20.1(A) R49.1 R50.1 R53.1 R54.1 R57.1 R58.1 R61.1 R62.1 R64.1 R66.1
SDADC3_AIN0M: D18.3(K) R60.2 ; port SDADC3_AIN0M
SDADC3_AIN0P: D16.3(K) R56.2 ; port SDADC3_AIN0P
SDADC3_AIN2M: D14.3(K) R52.2 ; port SDADC3_AIN2M
SDADC3_AIN2P: D12.3(K) R48.2 ; port SDADC3_AIN2P
SDADC3_AIN4M: D20.3(K) R65.2 ; port SDADC3_AIN4M
SDADC3_AIN4P: D19.3(K) R63.2 ; port SDADC3_AIN4P
SDADC3_AIN6M: D17.3(K) R59.2 ; port SDADC3_AIN6M
SDADC3_AIN6P: D15.3(K) R55.2 ; port SDADC3_AIN6P
SDADC3_AIN8M: D13.3(K) R51.2 ; port SDADC3_AIN8M
SDADC3_AIN8P: D11.3(K) R47.2 ; port SDADC3_AIN8P
TERMINAL_SDDADC0N: F4.1 J7.2(Pin_2) ; port TERMINAL_SDDADC0N
TERMINAL_SDDADC0P: F2.1 J7.1(Pin_1) ; port TERMINAL_SDDADC0P
TERMINAL_SDDADC1N: F8.1 J7.4(Pin_4) ; port TERMINAL_SDDADC1N
TERMINAL_SDDADC1P: F6.1 J7.3(Pin_3) ; port TERMINAL_SDDADC1P
TERMINAL_SDDADC2N: F11.1 J7.6(Pin_6) ; port TERMINAL_SDDADC2N
TERMINAL_SDDADC2P: F10.1 J7.5(Pin_5) ; port TERMINAL_SDDADC2P
TERMINAL_SDDADC3N: F5.1 J7.8(Pin_8) ; port TERMINAL_SDDADC3N
TERMINAL_SDDADC3P: F3.1 J7.7(Pin_7) ; port TERMINAL_SDDADC3P
TERMINAL_SDDADC4N: F9.1 J7.10(Pin_10) ; port TERMINAL_SDDADC4N
TERMINAL_SDDADC4P: F7.1 J7.9(Pin_9) ; port TERMINAL_SDDADC4P
NetF2_2: F2.2 R47.1 R49.2
NetF3_2: F3.2 R48.1 R50.2
NetF4_2: F4.2 R51.1 R53.2
NetF5_2: F5.2 R52.1 R54.2
NetF6_2: F6.2 R55.1 R57.2
NetF7_2: F7.2 R56.1 R58.2
NetF8_2: F8.2 R59.1 R61.2
NetF9_2: F9.2 R60.1 R62.2
NetF10_2: F10.2 R63.1 R64.2
NetF11_2: F11.2 R65.1 R66.2

### Notes on the sheet
- Here we convert 4-20mA to 0.64-3.2V due to the 160 ohm resistor.
- protecting the zener diode and the zener diode protecting the analog input of the controller.
- NOTE:
- Protection is available due to polyfuse and the 160 ohm resistor for
- Sub-system:
- Project:
- Design by:
- Sheet title:
- Sheet
- of
- Checked by:
- Approved by:
- Doc No:
- Revision:
- Size:
- Date:
- A3

### Library data of the parts
D11-D20 = BZX84C3V6LT1G: MP: BZX84C10LT1G; Package: None; Price: None; Value: *; Availability: Unavailable
F2-F11 = Polyfuse 0603
R47-R66 = RES 160R 0603: RES, 160, 5%, 0.1 W, AEC-Q200 Grade 0, 0603; Manufacturer: Vishay-Dale; Power_W: 100mW; TempCo: 200 ppm/C; Value_Code: 20R0; Value: 20; EIA_Code: E24; SizeX_mm: 1.6; SizeY_mm: 0.8; SizeZ_mm: 1; Value2: 0.1W; SizeArea_mm2: 1.28; CompType: Resistor; AEC Qualified: Y; VDC_V: 75V; AEC Category: Q200; AEC Grade: 0; Supplier Part Number 2: 59M6784; Supplier 2: Newark; Supplier Part Number 3: 71-CRCW0603J-20-E3; Supplier 3: Mouser; RoHS: E; Value1: 5%; MountType: SMT; Supplier 1: Digi-Key; PackageReference: 0603; Tolerance_%: 5%; Res_ohm: 20; PartNumber: CRCW060320R0JNEA; ComponentLink1Description: Datasheet link; Supplier Part Number 1: 541-20GCT-ND; Technology: Thick Film; ComponentLink1URL: http://www.vishay.com/docs/20035/dcrcwe3.pdf

## Sheet 08_INPUTCAPTURE_ENCODER.SchDoc
size 420 x 297 mm; SheetNumber: 8; SheetTotal: 12
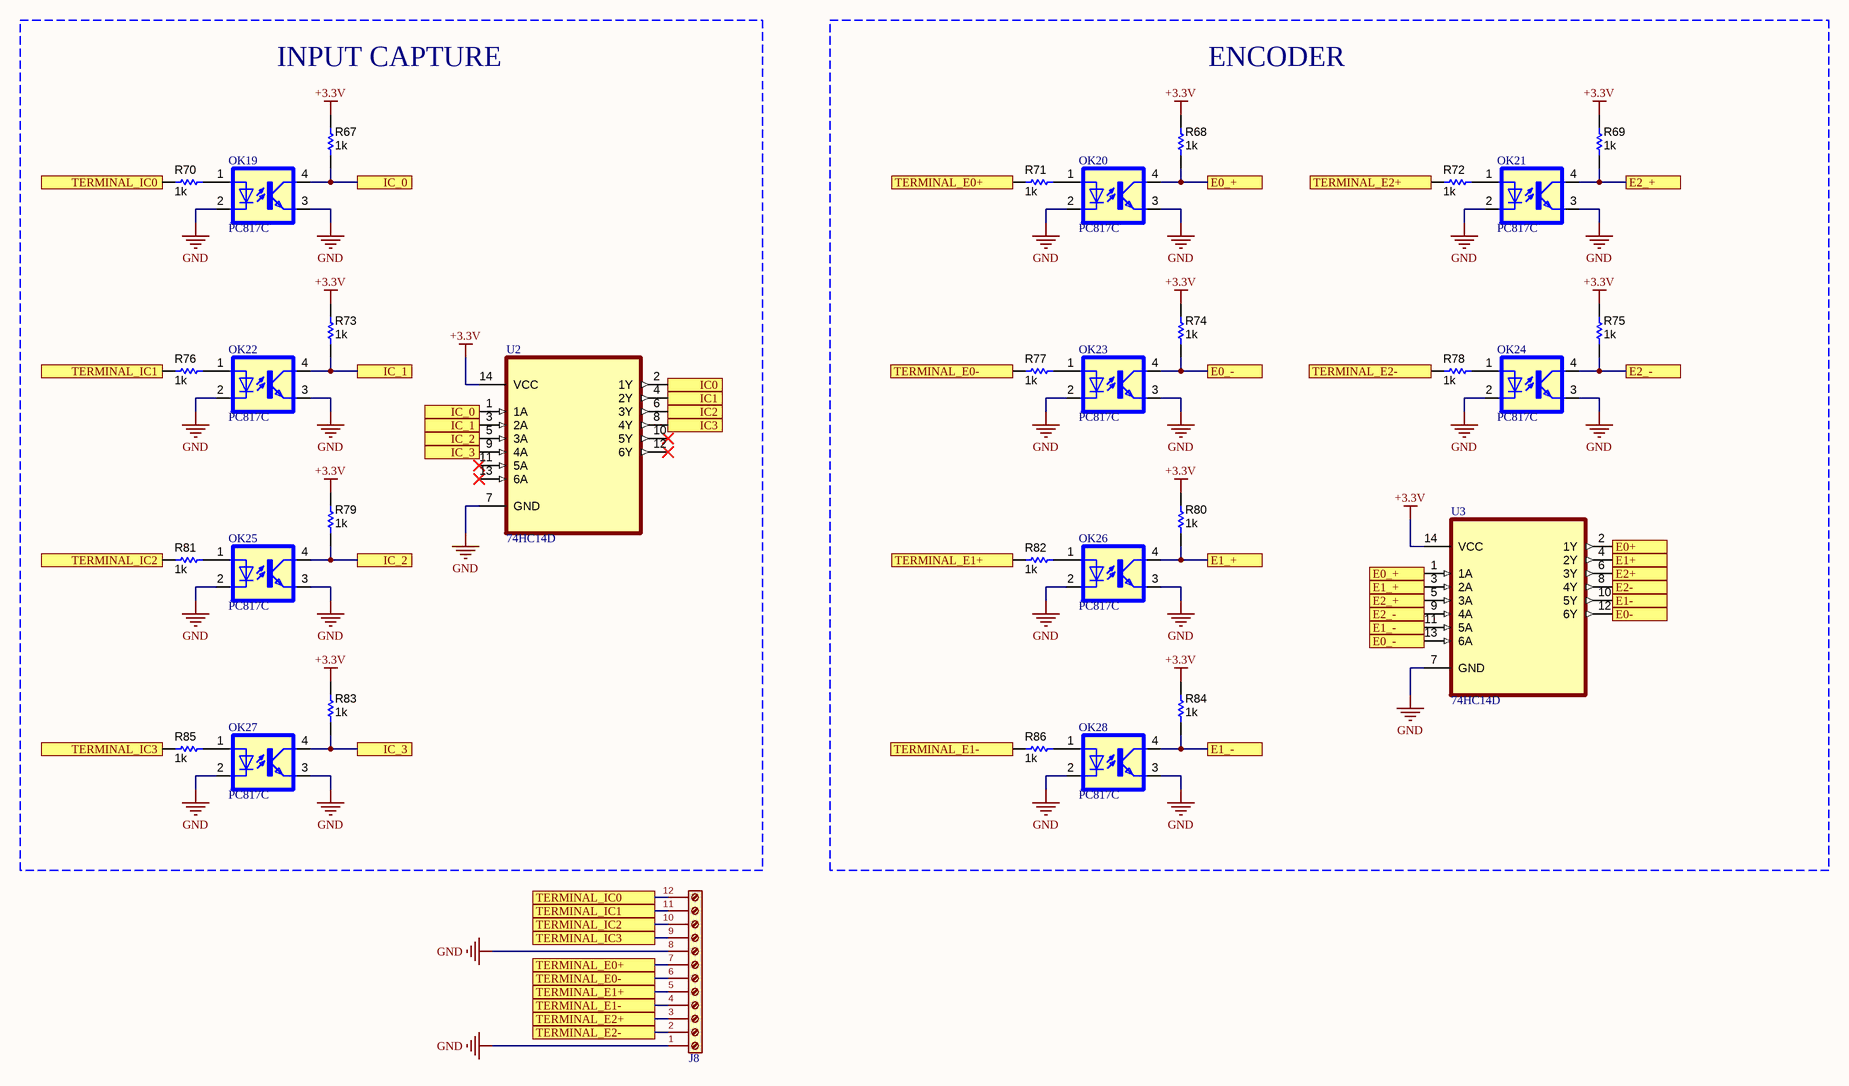
[diagram p3: 08_INPUTCAPTURE_ENCODER.SchDoc]

### Parts
J8  Terminal_01x12_P5.00  [TerminalBlock_Phoenix_PT-1,5-12-5.0-H_1x12_P5.00mm_Horizontal]  (value not drawn)
OK19  PC817C  [SOP254P975X460-4N]
OK20  PC817C  [SOP254P975X460-4N]
OK21  PC817C  [SOP254P975X460-4N]
OK22  PC817C  [SOP254P975X460-4N]
OK23  PC817C  [SOP254P975X460-4N]
OK24  PC817C  [SOP254P975X460-4N]
OK25  PC817C  [SOP254P975X460-4N]
OK26  PC817C  [SOP254P975X460-4N]
OK27  PC817C  [SOP254P975X460-4N]
OK28  PC817C  [SOP254P975X460-4N]
R67  ValueDisplayed: 1k  [0603]  (hidden comment: MCT06030Z0000ZP500)
R68  ValueDisplayed: 1k  [0603]  (hidden comment: MCT06030Z0000ZP500)
R69  ValueDisplayed: 1k  [0603]  (hidden comment: MCT06030Z0000ZP500)
R70  ValueDisplayed: 1k  [0603]  (hidden comment: MCT06030Z0000ZP500)
R71  ValueDisplayed: 1k  [0603]  (hidden comment: MCT06030Z0000ZP500)
R72  ValueDisplayed: 1k  [0603]  (hidden comment: MCT06030Z0000ZP500)
R73  ValueDisplayed: 1k  [0603]  (hidden comment: MCT06030Z0000ZP500)
R74  ValueDisplayed: 1k  [0603]  (hidden comment: MCT06030Z0000ZP500)
R75  ValueDisplayed: 1k  [0603]  (hidden comment: MCT06030Z0000ZP500)
R76  ValueDisplayed: 1k  [0603]  (hidden comment: MCT06030Z0000ZP500)
R77  ValueDisplayed: 1k  [0603]  (hidden comment: MCT06030Z0000ZP500)
R78  ValueDisplayed: 1k  [0603]  (hidden comment: MCT06030Z0000ZP500)
R79  ValueDisplayed: 1k  [0603]  (hidden comment: MCT06030Z0000ZP500)
R80  ValueDisplayed: 1k  [0603]  (hidden comment: MCT06030Z0000ZP500)
R81  ValueDisplayed: 1k  [0603]  (hidden comment: MCT06030Z0000ZP500)
R82  ValueDisplayed: 1k  [0603]  (hidden comment: MCT06030Z0000ZP500)
R83  ValueDisplayed: 1k  [0603]  (hidden comment: MCT06030Z0000ZP500)
R84  ValueDisplayed: 1k  [0603]  (hidden comment: MCT06030Z0000ZP500)
R85  ValueDisplayed: 1k  [0603]  (hidden comment: MCT06030Z0000ZP500)
R86  ValueDisplayed: 1k  [0603]  (hidden comment: MCT06030Z0000ZP500)
U2  74HC14D  [SOIC127P600X175-14N]
U3  74HC14D  [SOIC127P600X175-14N]

### Blocks framed on the sheet
INPUT CAPTURE: OK19 OK22 OK25 OK27 R67 R70 R73 R76 R79 R81 R83 R85 U2
ENCODER: OK20 OK21 OK23 OK24 OK26 OK28 R68 R69 R71 R72 R74 R75 R77 R78 R80 R82 R84 R86 U3

### Ports
E0+ (see 04_STM32F373VBTx[6B]), E0- (see 04_STM32F373VBTx[6B]), E0_+ (see 08_INPUTCAPTURE_ENCODER[4A]), E0_+ (see 08_INPUTCAPTURE_ENCODER[4B]), E0_- (see 08_INPUTCAPTURE_ENCODER[4B]), E1+ (see 04_STM32F373VBTx[5C]), E1- (see 04_STM32F373VBTx[5C]), E1_+ (see 08_INPUTCAPTURE_ENCODER[4B]), E1_- (see 08_INPUTCAPTURE_ENCODER[4B]), E2+ (see 04_STM32F373VBTx[5B]), E2- (see 04_STM32F373VBTx[5B]), E2_+ (see 08_INPUTCAPTURE_ENCODER[4B]), E2_+ (see 08_INPUTCAPTURE_ENCODER[5A]), E2_- (see 08_INPUTCAPTURE_ENCODER[4B]), E2_- (see 08_INPUTCAPTURE_ENCODER[5B]), IC0 (see 04_STM32F373VBTx[6B]), IC1 (see 04_STM32F373VBTx[6B]), IC2 (see 04_STM32F373VBTx[5B]), IC3 (see 04_STM32F373VBTx[5B]), IC_0 (see 08_INPUTCAPTURE_ENCODER[2A]), IC_0 (see 08_INPUTCAPTURE_ENCODER[2B]), IC_1 (see 08_INPUTCAPTURE_ENCODER[2B]), IC_2 (see 08_INPUTCAPTURE_ENCODER[2B]), IC_3 (see 08_INPUTCAPTURE_ENCODER[2B]), TERMINAL_E0+ (see 08_INPUTCAPTURE_ENCODER[2C]), TERMINAL_E0+ (see 08_INPUTCAPTURE_ENCODER[3A]), TERMINAL_E0- (see 08_INPUTCAPTURE_ENCODER[2C]), TERMINAL_E0- (see 08_INPUTCAPTURE_ENCODER[3B]), TERMINAL_E1+ (see 08_INPUTCAPTURE_ENCODER[2C]), TERMINAL_E1+ (see 08_INPUTCAPTURE_ENCODER[3B]), TERMINAL_E1- (see 08_INPUTCAPTURE_ENCODER[2C]), TERMINAL_E1- (see 08_INPUTCAPTURE_ENCODER[3B]), TERMINAL_E2+ (see 08_INPUTCAPTURE_ENCODER[2C]), TERMINAL_E2+ (see 08_INPUTCAPTURE_ENCODER[4A]), TERMINAL_E2- (see 08_INPUTCAPTURE_ENCODER[2C]), TERMINAL_E2- (see 08_INPUTCAPTURE_ENCODER[4B]), TERMINAL_IC0 (see 08_INPUTCAPTURE_ENCODER[1A]), TERMINAL_IC0 (see 08_INPUTCAPTURE_ENCODER[2C]), TERMINAL_IC1 (see 08_INPUTCAPTURE_ENCODER[1B]), TERMINAL_IC1 (see 08_INPUTCAPTURE_ENCODER[2C]), TERMINAL_IC2 (see 08_INPUTCAPTURE_ENCODER[1B]), TERMINAL_IC2 (see 08_INPUTCAPTURE_ENCODER[2C]), TERMINAL_IC3 (see 08_INPUTCAPTURE_ENCODER[1B]), TERMINAL_IC3 (see 08_INPUTCAPTURE_ENCODER[2C])

### Nets
+3.3V: R67.2 R68.2 R69.2 R73.2 R74.2 R75.2 R79.2 R80.2 R83.2 R84.2 U2.14(VCC) U3.14(VCC)
GND: J8.1(Pin_1) J8.8(Pin_8) OK19.2(C) OK19.3(EMIT) OK20.2(C) OK20.3(EMIT) OK21.2(C) OK21.3(EMIT) OK22.2(C) OK22.3(EMIT) OK23.2(C) OK23.3(EMIT) OK24.2(C) OK24.3(EMIT) OK25.2(C) OK25.3(EMIT) OK26.2(C) OK26.3(EMIT) OK27.2(C) OK27.3(EMIT) OK28.2(C) OK28.3(EMIT) U2.7(GND) U3.7(GND)
E0+: U3.2(1Y) ; port E0+
E0-: U3.12(6Y) ; port E0-
E0_+: OK20.4(COL) R68.1 U3.1(1A) ; port E0_+
E0_-: OK23.4(COL) R74.1 U3.13(6A) ; port E0_-
E1+: U3.4(2Y) ; port E1+
E1-: U3.10(5Y) ; port E1-
E1_+: OK26.4(COL) R80.1 U3.3(2A) ; port E1_+
E1_-: OK28.4(COL) R84.1 U3.11(5A) ; port E1_-
E2+: U3.6(3Y) ; port E2+
E2-: U3.8(4Y) ; port E2-
E2_+: OK21.4(COL) R69.1 U3.5(3A) ; port E2_+
E2_-: OK24.4(COL) R75.1 U3.9(4A) ; port E2_-
IC0: U2.2(1Y) ; port IC0
IC1: U2.4(2Y) ; port IC1
IC2: U2.6(3Y) ; port IC2
IC3: U2.8(4Y) ; port IC3
IC_0: OK19.4(COL) R67.1 U2.1(1A) ; port IC_0
IC_1: OK22.4(COL) R73.1 U2.3(2A) ; port IC_1
IC_2: OK25.4(COL) R79.1 U2.5(3A) ; port IC_2
IC_3: OK27.4(COL) R83.1 U2.9(4A) ; port IC_3
TERMINAL_E0+: J8.7(Pin_7) R71.1 ; port TERMINAL_E0+
TERMINAL_E0-: J8.6(Pin_6) R77.1 ; port TERMINAL_E0-
TERMINAL_E1+: J8.5(Pin_5) R82.1 ; port TERMINAL_E1+
TERMINAL_E1-: J8.4(Pin_4) R86.1 ; port TERMINAL_E1-
TERMINAL_E2+: J8.3(Pin_3) R72.1 ; port TERMINAL_E2+
TERMINAL_E2-: J8.2(Pin_2) R78.1 ; port TERMINAL_E2-
TERMINAL_IC0: J8.12(Pin_12) R70.1 ; port TERMINAL_IC0
TERMINAL_IC1: J8.11(Pin_11) R76.1 ; port TERMINAL_IC1
TERMINAL_IC2: J8.10(Pin_10) R81.1 ; port TERMINAL_IC2
TERMINAL_IC3: J8.9(Pin_9) R85.1 ; port TERMINAL_IC3
NetOK19_1: OK19.1(A) R70.2
NetOK20_1: OK20.1(A) R71.2
NetOK21_1: OK21.1(A) R72.2
NetOK22_1: OK22.1(A) R76.2
NetOK23_1: OK23.1(A) R77.2
NetOK24_1: OK24.1(A) R78.2
NetOK25_1: OK25.1(A) R81.2
NetOK26_1: OK26.1(A) R82.2
NetOK27_1: OK27.1(A) R85.2
NetOK28_1: OK28.1(A) R86.2

Not connected (* = marked no-connect by the designer): U2 10(5Y)* 11(5A)* 12(6Y)* 13(6A)*

### Notes on the sheet
- Sub-system:
- Project:
- Design by:
- Sheet title:
- Sheet
- of
- Checked by:
- Approved by:
- Doc No:
- Revision:
- Size:
- Date:
- A3

### Library data of the parts
OK19-OK28 = PC817C: as OK11 on sheet 06_DIGITAL; SnapEDA_Link: https://www.snapeda.com/parts/PC817/Renesas/view-part/?ref=snap; Package: None; Value: *; Check_prices: https://www.snapeda.com/parts/PC817/Renesas/view-part/?ref=eda
R67-R86 = RES 0R 0603: RES, 0, 5%, 0.125 W, 0603; Manufacturer: Vishay/Beyschlag; Power_W: 125mW; TempCo: ppm/C; Value_Code: 0000; U/M: EA; Value: 0; EIA_Code: E24; SizeX_mm: 1.6; SizeY_mm: 0.8; SizeZ_mm: 1; Value2: 0.125W; SizeArea_mm2: 1.28; CompType: Resistor; AEC Qualified: N; AEC Category: Q200; Supplier Part Number 2: 96Y9454; Publisher: Texas Instruments; Supplier 2: Newark; Supplier Part Number 3: 594-MCT06030Z0000ZP5; Supplier 3: Mouser; Published: 2008-06-26; RoHS: Y; Value1: 5%; MountType: SMT; Supplier 1: Digi-Key; PackageReference: 0603; Tolerance_%: 5%; Res_ohm: 0; LatestRevisionDate: 2017-03-09; PartNumber: MCT06030Z0000ZP500; ComponentLink1Description: Datasheet link; AEC Grade: N/A; Supplier Part Number 1: MCT0603-0.0-ZZCT-ND; Technology: Thin Film; ComponentLink1URL: http://www.vishay.com/docs/28705/mcx0x0xpro.pdf
U2 U3 = 74HC14D: Inverter IC 6 Channel Schmitt Trigger 14-SOIC; MF: Toshiba; SnapEDA_Link: https://www.snapeda.com/parts/74HC14D/Toshiba/view-part/?ref=snap; Package: SO14-14 Nexperia USA Inc.; Value: *; MP: 74HC14D; Check_prices: https://www.snapeda.com/parts/74HC14D/Toshiba/view-part/?ref=eda